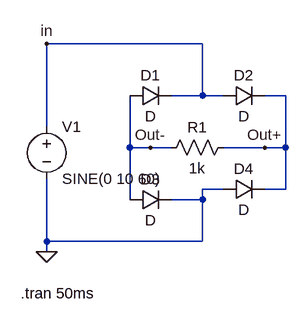
[diagram p0: schematic 2.asc]
2.asc, the LTspice schematic file:
Version 4.1
SHEET 1 880 680
WIRE 304 16 64 16
WIRE 304 96 304 16
WIRE 304 96 256 96
WIRE 336 96 304 96
WIRE 432 96 400 96
WIRE 64 144 64 16
WIRE 192 176 192 96
WIRE 224 176 192 176
WIRE 256 176 224 176
WIRE 400 176 336 176
WIRE 432 176 432 96
WIRE 432 176 400 176
WIRE 336 240 304 240
WIRE 432 240 432 176
WIRE 432 240 400 240
WIRE 192 256 192 176
WIRE 304 256 304 240
WIRE 304 256 256 256
WIRE 64 320 64 224
WIRE 304 320 304 256
WIRE 304 320 64 320
WIRE 64 336 64 320
FLAG 64 336 0
FLAG 224 176 Out-
FLAG 400 176 Out+
FLAG 64 16 in
SYMBOL voltage 64 128 R0
SYMATTR InstName V1
SYMATTR Value SINE(0 10 60)
SYMBOL diode 192 112 R270
WINDOW 0 32 32 VTop 2
WINDOW 3 0 32 VBottom 2
SYMATTR InstName D1
SYMBOL diode 336 112 R270
WINDOW 0 32 32 VTop 2
WINDOW 3 0 32 VBottom 2
SYMATTR InstName D2
SYMBOL diode 192 272 R270
WINDOW 0 32 32 VTop 2
WINDOW 3 0 32 VBottom 2
SYMATTR InstName D3
SYMBOL diode 336 256 R270
WINDOW 0 32 32 VTop 2
WINDOW 3 0 32 VBottom 2
SYMATTR InstName D4
SYMBOL res 352 160 R90
WINDOW 0 0 56 VBottom 2
WINDOW 3 32 56 VTop 2
SYMATTR InstName R1
SYMATTR Value 1k
TEXT 24 400 Left 2 !.tran 50ms

The netlist it stands for:
* 2.asc
V1 in 0 SINE(0 10 60)
D1 Out- in D
D2 in Out+ D
D3 Out- 0 D
D4 0 Out+ D
R1 Out+ Out- 1k
.model D D
.lib standard.dio
.tran 50ms
.backanno
.end